# Altium project Controller_Board.PrjPcb
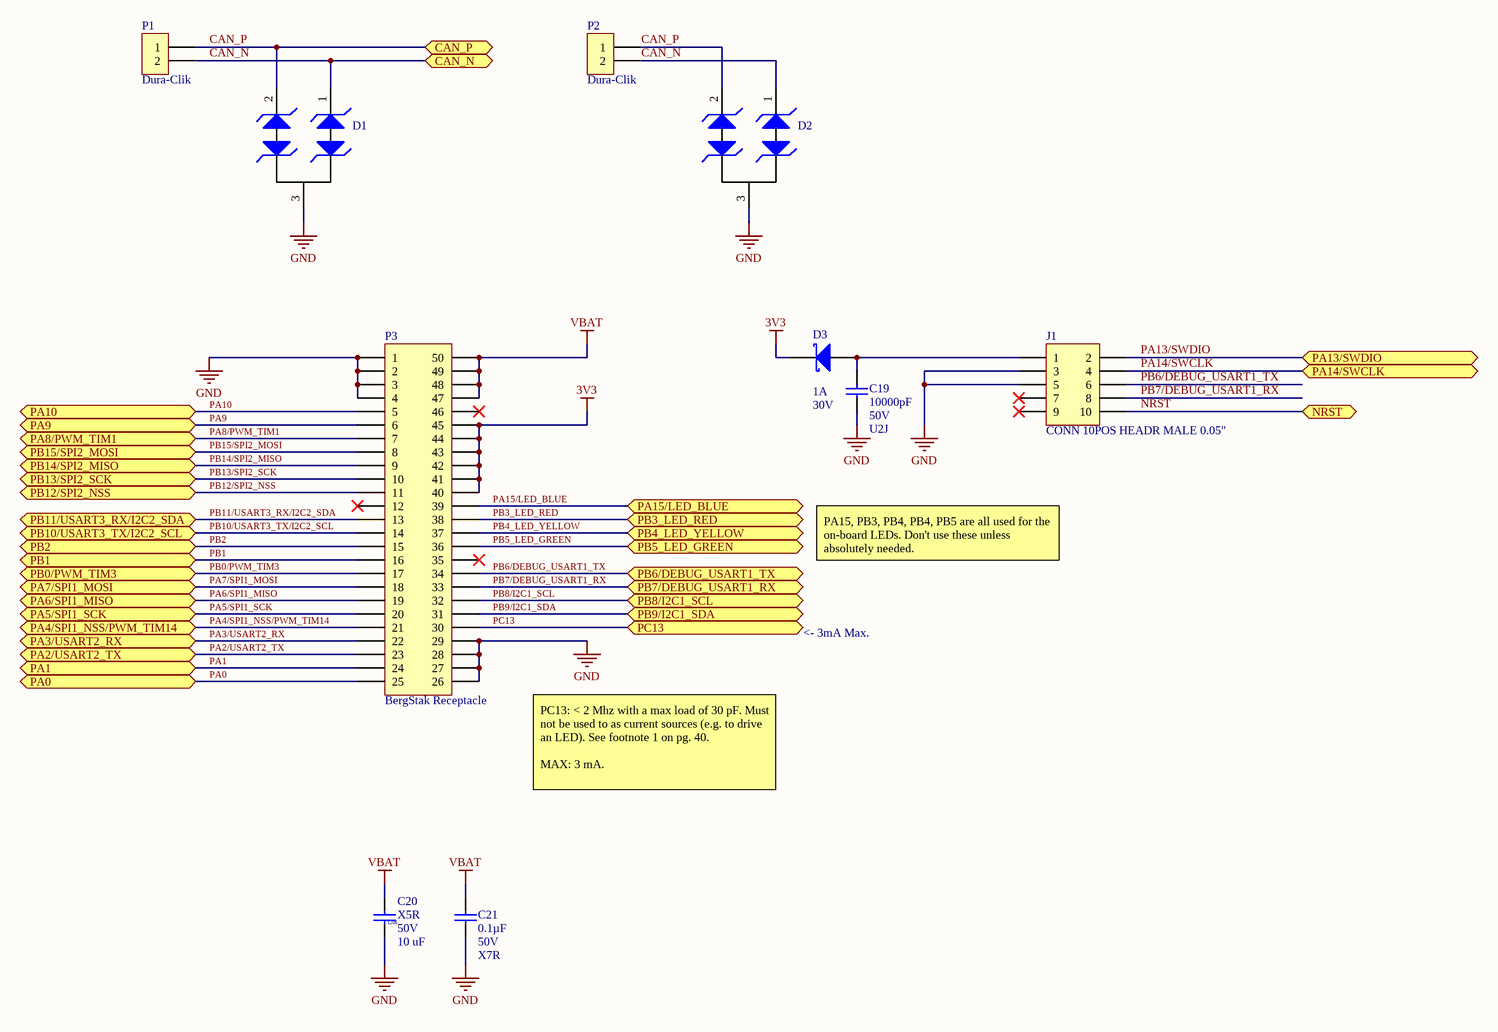
[diagram p0: Controller Board - Connectors.SchDoc]
ProjectRevision: 7.0; ProjectAuthor: Taiping Li; MSPartNumber: MS40001-07; author: Taiping
3 sheets, 48 parts. Net scope: flat (ports and power ports of the same name join across sheets).
Board file: Controller_Board.PcbDoc
Sheets:
  Controller Board - Connectors.SchDoc
  Controller Board - Microcontroller.SchDoc
  Controller_Board.SchDoc

## Sheet Controller Board - Connectors.SchDoc: Controller Board - Connectors
size B; Organization: Midnight Sun Solar Rayce Car Team; Address1: University of Waterloo; Address2: 200 University Ave W; Address3: Waterloo, ON, Canada; Address4: N2L 3E9; DocumentNumber: 1; SheetNumber: 1; SheetTotal: 3; Website: www.uwmidsun.com; ProjectName: ProjectName

### Parts
C19  Capacitance: 10000pF  Voltage: 50V  Temperature Coefficient: U2J  [CAP, 0603]  (hidden comment: CAP CER 10nF 50V 5% X7R 0603)
C20  Rating: X5R  Voltage Rating: 50V  Capacitance: 10 uF  [CAP, 1206]  (hidden comment: CAP CER 10uF 50V 20% X5R 1206)
C21  Capacitance: 0.1µF  Voltage: 50V  Temperature Coefficient: X7R  [CAP, 0603]  (hidden comment: CAP CER 0.1UF 50V 10% X7R 0603)
D1  DIODE TVS 24VWM 70VC SOT23  [MOSFET P-CH 30V 3.8A SOT-23]  (value not drawn)
D2  DIODE TVS 24VWM 70VC SOT23  [MOSFET P-CH 30V 3.8A SOT-23]  (value not drawn)
D3  Current - Average Rectified (Io): 1A  Voltage - DC Reverse (Vr) (Max): 30V  [DIODE SCHOTTKY 30V 1A POWERDI123]  (hidden comment: DIODE SCHOTTKY 30V 1A POWERDI123)
J1  CONN 10POS HEADR MALE 0.05"  [CONN, 10POS 0.05" Debug Header]
P1  Dura-Clik  [CONN, 2POS Dura-Click Vertical]
P2  Dura-Clik  [CONN, 2POS Dura-Click Vertical]
P3  Series: BergStak Receptacle  [CONN, Bergstak 50 Pos Receptacle]  (hidden comment: CONN 50POS Bergstak Receptacle 0.02")

### Ports
CAN_N (bidir), CAN_P (bidir), NRST (bidir), PA0 (bidir), PA1 (bidir), PA2/USART2_TX (bidir), PA3/USART2_RX (bidir), PA4/SPI1_NSS/PWM_TIM14 (bidir), PA5/SPI1_SCK (bidir), PA6/SPI1_MISO (bidir), PA7/SPI1_MOSI (bidir), PA8/PWM_TIM1 (bidir), PA9 (bidir), PA10 (bidir), PA13/SWDIO (bidir), PA14/SWCLK (bidir), PA15/LED_BLUE (bidir), PB0/PWM_TIM3 (bidir), PB1 (bidir), PB2 (bidir), PB3_LED_RED (bidir), PB4_LED_YELLOW (bidir), PB5_LED_GREEN (bidir), PB6/DEBUG_USART1_TX (bidir), PB7/DEBUG_USART1_RX (bidir), PB8/I2C1_SCL (bidir), PB9/I2C1_SDA (bidir), PB10/USART3_TX/I2C2_SCL (bidir), PB11/USART3_RX/I2C2_SDA (bidir), PB12/SPI2_NSS (bidir), PB13/SPI2_SCK (bidir), PB14/SPI2_MISO (bidir), PB15/SPI2_MOSI (bidir), PC13 (bidir)

### Nets
3V3: D3.2(K) P3.40 P3.41 P3.42 P3.43 P3.44 P3.45
GND: C19.2 C20.2 C21.2 D1.3(Common_Cathode) D2.3(Common_Cathode) J1.3 J1.5 P3.1 P3.2 P3.3 P3.4 P3.26 P3.27 P3.28 P3.29
VBAT: C20.1 C21.1 P3.47 P3.48 P3.49 P3.50
CAN_N: D1.1(Cathode1) D2.1(Cathode1) P1.2 P2.2 ; port CAN_N
CAN_P: D1.2(Cathode2) D2.2(Cathode2) P1.1 P2.1 ; port CAN_P
NRST: J1.10 ; port NRST
PA0: P3.25 ; port PA0
PA1: P3.24 ; port PA1
PA2/USART2_TX: P3.23 ; port PA2/USART2_TX
PA3/USART2_RX: P3.22 ; port PA3/USART2_RX
PA4/SPI1_NSS/PWM_TIM14: P3.21 ; port PA4/SPI1_NSS/PWM_TIM14
PA5/SPI1_SCK: P3.20 ; port PA5/SPI1_SCK
PA6/SPI1_MISO: P3.19 ; port PA6/SPI1_MISO
PA7/SPI1_MOSI: P3.18 ; port PA7/SPI1_MOSI
PA8/PWM_TIM1: P3.7 ; port PA8/PWM_TIM1
PA9: P3.6 ; port PA9
PA10: P3.5 ; port PA10
PA13/SWDIO: J1.2 ; port PA13/SWDIO
PA14/SWCLK: J1.4 ; port PA14/SWCLK
PA15/LED_BLUE: P3.39 ; port PA15/LED_BLUE
PB0/PWM_TIM3: P3.17 ; port PB0/PWM_TIM3
PB1: P3.16 ; port PB1
PB2: P3.15 ; port PB2
PB3_LED_RED: P3.38 ; port PB3_LED_RED
PB4_LED_YELLOW: P3.37 ; port PB4_LED_YELLOW
PB5_LED_GREEN: P3.36 ; port PB5_LED_GREEN
PB6/DEBUG_USART1_TX: J1.6 P3.34 ; port PB6/DEBUG_USART1_TX
PB7/DEBUG_USART1_RX: J1.8 P3.33 ; port PB7/DEBUG_USART1_RX
PB8/I2C1_SCL: P3.32 ; port PB8/I2C1_SCL
PB9/I2C1_SDA: P3.31 ; port PB9/I2C1_SDA
PB10/USART3_TX/I2C2_SCL: P3.14 ; port PB10/USART3_TX/I2C2_SCL
PB11/USART3_RX/I2C2_SDA: P3.13 ; port PB11/USART3_RX/I2C2_SDA
PB12/SPI2_NSS: P3.11 ; port PB12/SPI2_NSS
PB13/SPI2_SCK: P3.10 ; port PB13/SPI2_SCK
PB14/SPI2_MISO: P3.9 ; port PB14/SPI2_MISO
PB15/SPI2_MOSI: P3.8 ; port PB15/SPI2_MOSI
PC13: P3.30 ; port PC13
NetC19_1: C19.1 D3.1(A) J1.1

Not connected (* = marked no-connect by the designer): J1 7* 9*; P3 12* 35* 46*

### Notes on the sheet
- PA15, PB3, PB4, PB4, PB5 are all used for the on-board LEDs. Don't use these unless absolutely needed.
- <- 3mA Max.
- PC13: < 2 Mhz with a max load of 30 pF. Must not be used to as current sources (e.g. to drive an LED). See footnote 1 on pg. 40.
  MAX: 3 mA.
- PROJECT
- DOCUMENT
- DRAWN BY
- LAST MODIFIED
- PART NUMBER
- REVISION
- SHEET
- VARIANT
- OF
- Engineering 5 - 1002
  University of Waterloo
  (519) 888-4567 x32978
  hardware@uwmidsun.com

### Library data of the parts
C19 = CAP CER 10nF 50V 5% X7R 0603: 10000pF ±5% 50V Ceramic Capacitor U2J 0603 (1608 Metric); Manufacturer 1: KEMET; Manufacturer Part Number 1: C0603C103J5JAC7867; Supplier 1: Digi-Key; Supplier Part Number 1: 399-13384-1-ND; Packaging: Cut Tape (CT); Part Status: Active; Operating Temperature: -55°C ~ 125°C; Ratings: -; Mounting Type: Surface Mount, MLCC; Package / Case: 0603 (1608 Metric); Size / Dimension: 0.063" L x 0.032" W (1.60mm x 0.80mm); Height - Seated (Max): -; Thickness (Max): 0.034" (0.87mm); Lead Spacing: -; Lead Style: -; ComponentLink1URL: http://www.kemet.com/docfinder?Partnumber=C0603C103J5JAC7867; ComponentLink1Description: http://www.kemet.com/docfinder?Partnumber=C0603C103J5JAC7867; Tolerance: ±5%; Failure Rate: -
C20 = CAP CER 10uF 50V 20% X5R 1206: 10µF ±20% 50V Ceramic Capacitor X5R 1206 (3216 Metric) /; Manufacturer: Murata; Manufacturer Part Number: GRT31CR61H106ME01L; Supplier 1: Digi-Key; Supplier Part Number 1: 490-12457-1-ND; RoHS: Yes; Stock 1: 449467; Pricing 1: 1 = 0.57000, 10 = 0.39800, 100 = 0.23910, 500 = 0.17930, 1000 = 0.15141 (USD); Mount: Surface Mount; Case/Package: 1206; Case Code (Metric): 3216; Case Code (Imperial): 1206; Min Operating Temperature: -55°C; Max Operating Temperature: 85°C; Packaging: Tape and Reel; Tolerance: 20%; Length: 0.126inch; Width: 0.063inch; Thickness: 0.071inch; Ratings: AEC-Q200
C21 = CAP CER 0.1UF 50V 10% X7R 0603: 0.10µF ±10% 50V Ceramic Capacitor X7R 0603 (1608 Metric); Manufacturer 1: AVX Corporation; Manufacturer Part Number 1: 06035C104KAT2A; Supplier 1: Digi-Key; Supplier Part Number 1: 478-5052-1-ND; Packaging: Cut Tape (CT); Part Status: Active; Operating Temperature: -55°C ~ 125°C; Ratings: -; Mounting Type: Surface Mount, MLCC; Package / Case: 0603 (1608 Metric); Size / Dimension: 0.063" L x 0.032" W (1.60mm x 0.81mm); Height - Seated (Max): -; Thickness (Max): 0.035" (0.90mm); Lead Spacing: -; Lead Style: -; ComponentLink1URL: http://datasheets.avx.com/X7RDielectric.pdf; ComponentLink1Description: http://datasheets.avx.com/X7RDielectric.pdf; Tolerance: ±10%
D1 D2 = DIODE TVS 24VWM 70VC SOT23: TVS DIODE 24VWM 70VC SOT23; Manufacturer 1: Nexperia USA Inc.; Manufacturer Part Number 1: PESD1CAN,215; Type: Zener; Voltage - Breakdown (Min): 25.4V; Voltage - Clamping (Max) @ Ipp: 70V; Current - Peak Pulse (10/1000µs): 3A (8/20µs); Power - Peak Pulse: 200W; Power Line Protection: No; Capacitance @ Frequency: 11pF @ 1MHz; Supplier 1: Digi-Key; Supplier Part Number 1: 1727-3817-1-ND; Packaging: Cut Tape (CT); Part Status: Active; Operating Temperature: -65°C ~ 150°C (TA); Mounting Type: Surface Mount; Package / Case: TO-236-3, SC-59, SOT-23-3; Supplier Device Package: SOT-23 (TO-236AB); ComponentLink1URL: http://assets.nexperia.com/documents/data-sheet/PESD1CAN.pdf; ComponentLink1Description: http://assets.nexperia.com/documents/data-sheet/PESD1CAN.pdf
D3 = DIODE SCHOTTKY 30V 1A POWERDI123: Diode Schottky 30V 1A Surface Mount PowerDI™ 123; Manufacturer: Diodes Incorporated; Manufacturer Part Number: DFLS130L-7; Speed: Fast Recovery =< 500ns, > 200mA (Io); Current - Reverse Leakage @ Vr: 1mA @ 30V; Capacitance @ Vr, F: 76pF @ 10V, 1MHz; Voltage - Forward (Vf) (Max) @ If: 310mV @ 1A; Supplier 1: Digi-Key; RoHS: RoHS Compliant; Category: Discrete Semiconductor Products; Stock 1: 68200; Packaging: Cut Tape (CT); Part Status: Active; Diode Type: Schottky; Mounting Type: Surface Mount; Package / Case: POWERDI®123; Supplier Device Package: PowerDI™ 123; Operating Temperature - Junction: -40°C ~ 125°C; ComponentLink1URL: https://www.diodes.com/assets/Datasheets/ds30492.pdf; ComponentLink1Description: https://www.diodes.com/assets/Datasheets/ds30492.pdf; Supplier Part Number 1: DFLS130LDICT-ND; Pricing 1: 1=0.7, 10=0.599, 100=0.447, 500=0.35126, 1000=0.27142 (CAD)
J1 = CONN 10POS HEADR MALE 0.05": 10 Positions Header Connector 0.050" (1.27mm) Surface Mount Gold; Manufacturer 1: Amphenol FCI; Manufacturer Part Number 1: 20021121-00010C4LF; Style: Board to Board; Shrouding: Unshrouded; Number of Positions: 10; Number of Positions Loaded: All; Contact Length - Mating: 0.120" (3.05mm); Material Flammability Rating: UL94 V-0; Supplier 1: Digi-Key; Supplier Part Number 1: 609-3695-1-ND; Packaging: Cut Tape (CT); Part Status: Active; Connector Type: Header; Contact Type: Male Pin; Number of Rows: 2; Row Spacing - Mating: 0.050" (1.27mm); Mounting Type: Surface Mount; Termination: Solder; Fastening Type: -; Contact Length - Post: -; Overall Contact Length: -; Insulation Height: -; Contact Shape: Square; Contact Finish - Mating: Gold; Contact Finish Thickness - Mating: 10µin (0.25µm); Contact Finish - Post: Tin; Contact Material: Copper Alloy; Insulation Material: Thermoplastic; Operating Temperature: -; Ingress Protection: -; Insulation Color: Black; Current Rating: -; Mated Stacking Heights: -; Contact Finish Thickness - Post: 50µin (1.27µm); ComponentLink1URL: http://portal.fciconnect.com/Comergent//fci/drawing/20021121.pdf; ComponentLink1Description: http://portal.fciconnect.com/Comergent//fci/drawing/20021121.pdf; Voltage: -; Pitch - Mating: 0.050" (1.27mm)
P1 P2 = CONN 2POS DURA-CLIK 0.079" VERT: 2 Positions Header, Shrouded Connector 0.079" (2.00mm) Surface Mount, Vertical Tin; Manufacturer: Molex, LLC; Manufacturer Part Number: 5600200220; Style: Board to Cable/Wire; Shrouding: Shrouded - 4 Wall; Number of Positions: 2; Number of Positions Loaded: All; Mated Stacking Heights: 9.3mm; Supplier 1: Digi-Key; RoHS: RoHS Compliant; Category: Connectors, Interconnects; Stock 1: 11912; Pricing 1: 1=1.16, 10=1.012, 25=0.952, 50=0.9122, 100=0.8727, 250=0.79336 (CAD); Packaging: Cut Tape (CT); Part Status: Active; Connector Type: Header; Contact Type: Male Pin; Pitch - Mating: 0.079" (2.00mm); Number of Rows: 1; Row Spacing - Mating: -; Mounting Type: Surface Mount; Termination: Solder; Fastening Type: Latch Lock; Contact Length - Mating: -; Contact Length - Post: -; Overall Contact Length: -; Insulation Height: 0.315" (8.00mm); Contact Shape: Square; Contact Finish - Mating: Tin; Contact Finish Thickness - Mating: -; Contact Finish - Post: Tin; Contact Material: Copper Alloy; Insulation Material: Polyamide (PA), Nylon; Features: Solder Retention; Operating Temperature: -; Ingress Protection: -; Material Flammability Rating: -; Insulation Color: Natural; Current Rating: -; Voltage Rating: -; Contact Finish Thickness - Post: -; Applications: Automotive, Industrial; ComponentLink1URL: http://www.molex.com/pdm_docs/sd/5600200220_sd.pdf; ComponentLink1Description: http://www.molex.com/pdm_docs/sd/5600200220_sd.pdf; Supplier Part Number 1: WM10862CT-ND
P3 = CONN 50POS Bergstak Receptacle 0.02": 50 Position Connector Receptacle, Center Strip Contacts Surface Mount Gold; Manufacturer 1: Amphenol FCI; Manufacturer Part Number 1: 10132798-052100LF; Number of Positions: 50; Mated Stacking Heights: 5mm, 5.5mm, 6mm; Pitch: 0.020" (0.50mm); Supplier 1: Digi-Key; Supplier Part Number 1: 609-5227-1-ND; Packaging: Cut Tape (CT); Part Status: Active; Connector Type: Receptacle, Center Strip Contacts; Number of Rows: 2; Mounting Type: Surface Mount; Contact Finish: Gold; Contact Finish Thickness: 1µin (0.025µm); Height Above Board: 0.106" (2.70mm); ComponentLink1URL: http://portal.fciconnect.com/Comergent//fci/drawing/10132798.pdf; ComponentLink1Description: http://portal.fciconnect.com/Comergent//fci/drawing/10132798.pdf

## Sheet Controller Board - Microcontroller.SchDoc: Controller Board - Microcontroller
size B; Organization: Midnight Sun Solar Rayce Car Team; Address1: University of Waterloo; Address2: 200 University Ave W; Address3: Waterloo, ON, Canada; Address4: N2L 3E9; DocumentNumber: 2; SheetNumber: 2; SheetTotal: 3; Website: www.uwmidsun.com; ProjectName: ProjectName
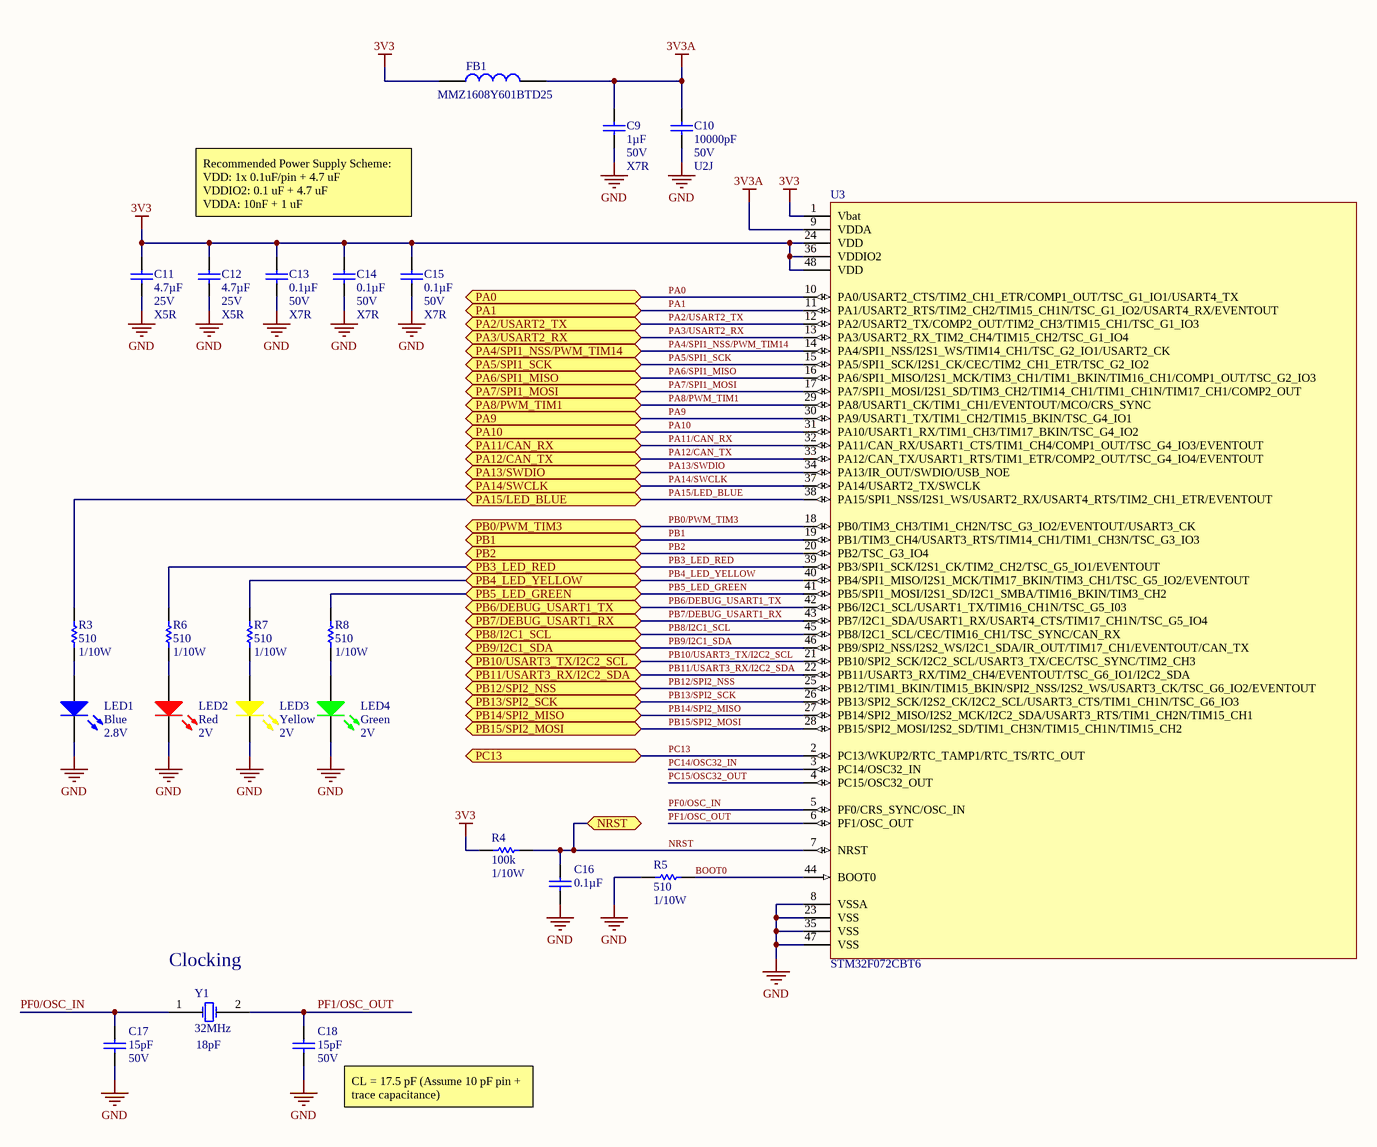
[diagram p1: Controller Board - Microcontroller.SchDoc]

### Parts
C9  Capacitance: 1µF  Voltage: 50V  Temperature Coefficient: X7R  [CAP, 0603]  (hidden comment: CAP CER 1UF 50V 10% X7R 0603)
C10  Capacitance: 10000pF  Voltage: 50V  Temperature Coefficient: U2J  [CAP, 0603]  (hidden comment: CAP CER 10nF 50V 5% X7R 0603)
C11  Capacitance: 4.7µF  Voltage: 25V  Temperature Coefficient: X5R  [CAP, 0603]  (hidden comment: CAP CER 4.7UF 25V 10% X5R 0603)
C12  Capacitance: 4.7µF  Voltage: 25V  Temperature Coefficient: X5R  [CAP, 0603]  (hidden comment: CAP CER 4.7UF 25V 10% X5R 0603)
C13  Capacitance: 0.1µF  Voltage: 50V  Temperature Coefficient: X7R  [CAP, 0603]  (hidden comment: CAP CER 0.1UF 50V 10% X7R 0603)
C14  Capacitance: 0.1µF  Voltage: 50V  Temperature Coefficient: X7R  [CAP, 0603]  (hidden comment: CAP CER 0.1UF 50V 10% X7R 0603)
C15  Capacitance: 0.1µF  Voltage: 50V  Temperature Coefficient: X7R  [CAP, 0603]  (hidden comment: CAP CER 0.1UF 50V 10% X7R 0603)
C16  Capacitance: 0.1µF  [CAP, 0603]  (hidden comment: CAP CER 0.1UF 50V 10% X7R 0603)
C17  Voltage: 50V  Capacitance: 15pF  [CAP, 0603]  (hidden comment: CAP CER 15PF 50V ±5% NPO 0603)
C18  Voltage: 50V  Capacitance: 15pF  [CAP, 0603]  (hidden comment: CAP CER 15PF 50V ±5% NPO 0603)
FB1  Manufacturer Part Number: MMZ1608Y601BTD25  [FB 0603]  (hidden comment: FB 600 OHM 1LN 0603)
LED1  Color: Blue  Voltage - Forward (Vf) (Typ): 2.8V  [LED_0603]  (hidden comment: LED BLUE CLEAR 2.8V 0603)
LED2  Color: Red  Voltage - Forward (Vf) (Typ): 2V  [LED_0603]  (hidden comment: LED RED CLEAR 2V 0603)
LED3  Color: Yellow  Voltage - Forward (Vf) (Typ): 2V  [LED_0603]  (hidden comment: LED YELLOW CLEAR 2.1V 0603)
LED4  Color: Green  Voltage - Forward (Vf) (Typ): 2V  [LED_0603]  (hidden comment: LED GREEN CLEAR 2V 0603)
R3  Resistance: 510  Power: 1/10W  [RES, 0603]  (hidden comment: RES 510 OHM 5% 1/10W 0603)
R4  Resistance: 100k  Power: 1/10W  [RES, 0603]  (hidden comment: RES 100K OHM 5% 1/8W 0603)
R5  Resistance: 510  Power: 1/10W  [RES, 0603]  (hidden comment: RES 510 OHM 5% 1/10W 0603)
R6  Resistance: 510  Power: 1/10W  [RES, 0603]  (hidden comment: RES 510 OHM 5% 1/10W 0603)
R7  Resistance: 510  Power: 1/10W  [RES, 0603]  (hidden comment: RES 510 OHM 5% 1/10W 0603)
R8  Resistance: 510  Power: 1/10W  [RES, 0603]  (hidden comment: RES 510 OHM 5% 1/10W 0603)
U3  Manufacturer Part Number 1: STM32F072CBT6  [TSQFP50P890X890X160-48M]  (hidden comment: IC MCU 32BIT 128KB FLASH 48LQFP)
Y1  Load Capacitance: 18pF  Frequency: 32MHz  [CRYSTAL ABM7]  (hidden comment: CRYSTAL 32 MHz 18PF 2-SMD)

### Ports
NRST (bidir), PA0 (bidir), PA1 (bidir), PA2/USART2_TX (bidir), PA3/USART2_RX (bidir), PA4/SPI1_NSS/PWM_TIM14 (bidir), PA5/SPI1_SCK (bidir), PA6/SPI1_MISO (bidir), PA7/SPI1_MOSI (bidir), PA8/PWM_TIM1 (bidir), PA9 (bidir), PA10 (bidir), PA11/CAN_RX (bidir), PA12/CAN_TX (bidir), PA13/SWDIO (bidir), PA14/SWCLK (bidir), PA15/LED_BLUE (bidir), PB0/PWM_TIM3 (bidir), PB1 (bidir), PB2 (bidir), PB3_LED_RED (bidir), PB4_LED_YELLOW (bidir), PB5_LED_GREEN (bidir), PB6/DEBUG_USART1_TX (bidir), PB7/DEBUG_USART1_RX (bidir), PB8/I2C1_SCL (bidir), PB9/I2C1_SDA (bidir), PB10/USART3_TX/I2C2_SCL (bidir), PB11/USART3_RX/I2C2_SDA (bidir), PB12/SPI2_NSS (bidir), PB13/SPI2_SCK (bidir), PB14/SPI2_MISO (bidir), PB15/SPI2_MOSI (bidir), PC13 (bidir)

### Nets
3V3: C11.1 C12.1 C13.1 C14.1 C15.1 FB1.1 R4.2 U3.1(Vbat) U3.24(VDD) U3.36(VDDIO2) U3.48(VDD)
3V3A: C9.1 C10.1 FB1.2 U3.9(VDDA)
GND: C9.2 C10.2 C11.2 C12.2 C13.2 C14.2 C15.2 C16.1 C17.1 C18.1 LED1.2(K) LED2.2(K) LED3.2(K) LED4.2(K) R5.1 U3.8(VSSA) U3.23(VSS) U3.35(VSS) U3.47(VSS)
BOOT0: R5.2 U3.44(BOOT0)
NRST: C16.2 R4.1 U3.7(NRST) ; port NRST
PA0: U3.10(PA0/USART2_CTS/TIM2_CH1_ETR/COMP1_OUT/TSC_G1_IO1/USART4_TX) ; port PA0
PA1: U3.11(PA1/USART2_RTS/TIM2_CH2/TIM15_CH1N/TSC_G1_IO2/USART4_RX/EVENTOUT) ; port PA1
PA2/USART2_TX: U3.12(PA2/USART2_TX/COMP2_OUT/TIM2_CH3/TIM15_CH1/TSC_G1_IO3) ; port PA2/USART2_TX
PA3/USART2_RX: U3.13(PA3/USART2_RX_TIM2_CH4/TIM15_CH2/TSC_G1_IO4) ; port PA3/USART2_RX
PA4/SPI1_NSS/PWM_TIM14: U3.14(PA4/SPI1_NSS/I2S1_WS/TIM14_CH1/TSC_G2_IO1/USART2_CK) ; port PA4/SPI1_NSS/PWM_TIM14
PA5/SPI1_SCK: U3.15(PA5/SPI1_SCK/I2S1_CK/CEC/TIM2_CH1_ETR/TSC_G2_IO2) ; port PA5/SPI1_SCK
PA6/SPI1_MISO: U3.16(PA6/SPI1_MISO/I2S1_MCK/TIM3_CH1/TIM1_BKIN/TIM16_CH1/COMP1_OUT/TSC_G2_IO3) ; port PA6/SPI1_MISO
PA7/SPI1_MOSI: U3.17(PA7/SPI1_MOSI/I2S1_SD/TIM3_CH2/TIM14_CH1/TIM1_CH1N/TIM17_CH1/COMP2_OUT) ; port PA7/SPI1_MOSI
PA8/PWM_TIM1: U3.29(PA8/USART1_CK/TIM1_CH1/EVENTOUT/MCO/CRS_SYNC) ; port PA8/PWM_TIM1
PA9: U3.30(PA9/USART1_TX/TIM1_CH2/TIM15_BKIN/TSC_G4_IO1) ; port PA9
PA10: U3.31(PA10/USART1_RX/TIM1_CH3/TIM17_BKIN/TSC_G4_IO2) ; port PA10
PA11/CAN_RX: U3.32(PA11/CAN_RX/USART1_CTS/TIM1_CH4/COMP1_OUT/TSC_G4_IO3/EVENTOUT) ; port PA11/CAN_RX
PA12/CAN_TX: U3.33(PA12/CAN_TX/USART1_RTS/TIM1_ETR/COMP2_OUT/TSC_G4_IO4/EVENTOUT) ; port PA12/CAN_TX
PA13/SWDIO: U3.34(PA13/IR_OUT/SWDIO/USB_NOE) ; port PA13/SWDIO
PA14/SWCLK: U3.37(PA14/USART2_TX/SWCLK) ; port PA14/SWCLK
PA15/LED_BLUE: R3.1 U3.38(PA15/SPI1_NSS/I2S1_WS/USART2_RX/USART4_RTS/TIM2_CH1_ETR/EVENTOUT) ; port PA15/LED_BLUE
PB0/PWM_TIM3: U3.18(PB0/TIM3_CH3/TIM1_CH2N/TSC_G3_IO2/EVENTOUT/USART3_CK) ; port PB0/PWM_TIM3
PB1: U3.19(PB1/TIM3_CH4/USART3_RTS/TIM14_CH1/TIM1_CH3N/TSC_G3_IO3) ; port PB1
PB2: U3.20(PB2/TSC_G3_IO4) ; port PB2
PB3_LED_RED: R6.1 U3.39(PB3/SPI1_SCK/I2S1_CK/TIM2_CH2/TSC_G5_IO1/EVENTOUT) ; port PB3_LED_RED
PB4_LED_YELLOW: R7.1 U3.40(PB4/SPI1_MISO/I2S1_MCK/TIM17_BKIN/TIM3_CH1/TSC_G5_IO2/EVENTOUT) ; port PB4_LED_YELLOW
PB5_LED_GREEN: R8.1 U3.41(PB5/SPI1_MOSI/I2S1_SD/I2C1_SMBA/TIM16_BKIN/TIM3_CH2) ; port PB5_LED_GREEN
PB6/DEBUG_USART1_TX: U3.42(PB6/I2C1_SCL/USART1_TX/TIM16_CH1N/TSC_G5_I03) ; port PB6/DEBUG_USART1_TX
PB7/DEBUG_USART1_RX: U3.43(PB7/I2C1_SDA/USART1_RX/USART4_CTS/TIM17_CH1N/TSC_G5_IO4) ; port PB7/DEBUG_USART1_RX
PB8/I2C1_SCL: U3.45(PB8/I2C1_SCL/CEC/TIM16_CH1/TSC_SYNC/CAN_RX) ; port PB8/I2C1_SCL
PB9/I2C1_SDA: U3.46(PB9/SPI2_NSS/I2S2_WS/I2C1_SDA/IR_OUT/TIM17_CH1/EVENTOUT/CAN_TX) ; port PB9/I2C1_SDA
PB10/USART3_TX/I2C2_SCL: U3.21(PB10/SPI2_SCK/I2C2_SCL/USART3_TX/CEC/TSC_SYNC/TIM2_CH3) ; port PB10/USART3_TX/I2C2_SCL
PB11/USART3_RX/I2C2_SDA: U3.22(PB11/USART3_RX/TIM2_CH4/EVENTOUT/TSC_G6_IO1/I2C2_SDA) ; port PB11/USART3_RX/I2C2_SDA
PB12/SPI2_NSS: U3.25(PB12/TIM1_BKIN/TIM15_BKIN/SPI2_NSS/I2S2_WS/USART3_CK/TSC_G6_IO2/EVENTOUT) ; port PB12/SPI2_NSS
PB13/SPI2_SCK: U3.26(PB13/SPI2_SCK/I2S2_CK/I2C2_SCL/USART3_CTS/TIM1_CH1N/TSC_G6_IO3) ; port PB13/SPI2_SCK
PB14/SPI2_MISO: U3.27(PB14/SPI2_MISO/I2S2_MCK/I2C2_SDA/USART3_RTS/TIM1_CH2N/TIM15_CH1) ; port PB14/SPI2_MISO
PB15/SPI2_MOSI: U3.28(PB15/SPI2_MOSI/I2S2_SD/TIM1_CH3N/TIM15_CH1N/TIM15_CH2) ; port PB15/SPI2_MOSI
PC13: U3.2(PC13/WKUP2/RTC_TAMP1/RTC_TS/RTC_OUT) ; port PC13
PC14/OSC32_IN: U3.3(PC14/OSC32_IN)
PC15/OSC32_OUT: U3.4(PC15/OSC32_OUT)
PF0/OSC_IN: C17.2 U3.5(PF0/CRS_SYNC/OSC_IN) Y1.1
PF1/OSC_OUT: C18.2 U3.6(PF1/OSC_OUT) Y1.2
NetLED1_1: LED1.1(A) R3.2
NetLED2_1: LED2.1(A) R6.2
NetLED3_1: LED3.1(A) R7.2
NetLED4_1: LED4.1(A) R8.2

### Notes on the sheet
- Recommended Power Supply Scheme:
  VDD: 1x 0.1uF/pin + 4.7 uF
  VDDIO2: 0.1 uF + 4.7 uF
  VDDA: 10nF + 1 uF
- (near Y1) Clocking
- (near C18) CL = 17.5 pF (Assume 10 pF pin + trace capacitance)
- PROJECT
- DOCUMENT
- DRAWN BY
- LAST MODIFIED
- PART NUMBER
- REVISION
- SHEET
- VARIANT
- OF
- Engineering 5 - 1002
  University of Waterloo
  (519) 888-4567 x32978
  hardware@uwmidsun.com

### Library data of the parts
C9 = CAP CER 1UF 50V 10% X7R 0603: 1µF ±10% 50V Ceramic Capacitor X7R 0603 (1608 Metric); Manufacturer 1: Taiyo Yuden; Manufacturer Part Number 1: UMK107AB7105KA-T; Supplier 1: Digi-Key; Supplier Part Number 1: 587-3247-1-ND; Packaging: Cut Tape (CT); Part Status: Active; Operating Temperature: -55°C ~ 125°C; Ratings: -; Mounting Type: Surface Mount, MLCC; Package / Case: 0603 (1608 Metric); Size / Dimension: 0.063" L x 0.031" W (1.60mm x 0.80mm); Height - Seated (Max): -; Thickness (Max): 0.037" (0.95mm); Lead Spacing: -; Lead Style: -; ComponentLink1URL: http://www.yuden.co.jp/productdata/catalog/en/mlcc_all_e.pdf; ComponentLink1Description: http://www.yuden.co.jp/productdata/catalog/en/mlcc_all_e.pdf; Tolerance: ±10%
C10 = CAP CER 10nF 50V 5% X7R 0603: as C19 on sheet Controller Board - Connectors; Supplier 1: Digi-Key; Supplier Part Number 1: 399-13384-1-ND; Packaging: Cut Tape (CT); Part Status: Active; Operating Temperature: -55°C ~ 125°C; Ratings: -; Failure Rate: -; Mounting Type: Surface Mount, MLCC; Package / Case: 0603 (1608 Metric); Size / Dimension: 0.063" L x 0.032" W (1.60mm x 0.80mm); Height - Seated (Max): -; Thickness (Max): 0.034" (0.87mm); Lead Spacing: -; Lead Style: -; ComponentLink1URL: http://www.kemet.com/docfinder?Partnumber=C0603C103J5JAC7867; ComponentLink1Description: http://www.kemet.com/docfinder?Partnumber=C0603C103J5JAC7867; Tolerance: ±5%
C11 C12 = CAP CER 4.7UF 25V 10% X5R 0603: 4.7µF ±10% 25V Ceramic Capacitor X5R 0603 (1608 Metric); Manufacturer 1: Murata Electronics North America; Manufacturer Part Number 1: GRM188R61E475KE11D; Supplier 1: Digi-Key; Supplier Part Number 1: 490-7203-1-ND; Packaging: Cut Tape (CT); Part Status: Active; Operating Temperature: -55°C ~ 85°C; Ratings: -; Mounting Type: Surface Mount, MLCC; Package / Case: 0603 (1608 Metric); Size / Dimension: 0.063" L x 0.031" W (1.60mm x 0.80mm); Height - Seated (Max): -; Thickness (Max): 0.031" (0.80mm); Lead Spacing: -; Lead Style: -; ComponentLink1URL: http://www.murata.com/~/media/webrenewal/support/library/catalog/products/capacitor/mlcc/c02e.ashx; ComponentLink1Description: http://www.murata.com/~/media/webrenewal/support/library/catalog/products/capacitor/mlcc/c02e.ashx; Tolerance: ±10%
C13-C16 = CAP CER 0.1UF 50V 10% X7R 0603: as C21 on sheet Controller Board - Connectors; Supplier 1: Digi-Key; Supplier Part Number 1: 478-5052-1-ND; Packaging: Cut Tape (CT); Part Status: Active; Operating Temperature: -55°C ~ 125°C; Ratings: -; Mounting Type: Surface Mount, MLCC; Package / Case: 0603 (1608 Metric); Size / Dimension: 0.063" L x 0.032" W (1.60mm x 0.81mm); Height - Seated (Max): -; Thickness (Max): 0.035" (0.90mm); Lead Spacing: -; Lead Style: -; ComponentLink1URL: http://datasheets.avx.com/X7RDielectric.pdf; ComponentLink1Description: http://datasheets.avx.com/X7RDielectric.pdf; Tolerance: ±10%
  C16: Voltage: 50V; Temperature Coefficient: X7R
C17 C18 = CAP CER 15PF 50V ±5% NPO 0603: 15pF ±5% 50V Ceramic Capacitor C0G, NP0 0603 (1608 Metric); Manufacturer 1: Yageo; Manufacturer Part Number 1: CC0603JRNPO9BN150; Supplier 1: Digi-Key; Supplier Part Number 1: 311-1060-1-ND; Packaging: Cut Tape (CT); Part Status: Active; Operating Temperature: -55°C ~ 125°C; Ratings: -; Failure Rate: -; Mounting Type: Surface Mount, MLCC; Package / Case: 0603 (1608 Metric); Size / Dimension: 0.063" L x 0.031" W (1.60mm x 0.80mm); Height - Seated (Max): -; Thickness (Max): 0.035" (0.90mm); Lead Spacing: -; Lead Style: -; ComponentLink1URL: http://www.yageo.com/documents/recent/UPY-GP_NP0_16V-to-50V_16.pdf; ComponentLink1Description: http://www.yageo.com/documents/recent/UPY-GP_NP0_16V-to-50V_16.pdf; Tolerance: ±5%; Temperature Coefficient: C0G, NP0
FB1 = FB 600 OHM 1LN 0603: FERRITE BEAD 600 OHM 0603 1LN; Manufacturer: TDK; Number of Lines: 1; Max Current Rating: 500mA; DC Resistance (DCR): 400mR; Impedance: 600R; Tolerance: 25%; Test Frequency: 100MHz; Supplier 1: Digi-Key; Supplier Part Number 1: 445-172850-1-ND; RoHS: Yes; Stock 1: 19540; Pricing 1: 1 = 0.10000, 10 = 0.07600, 25 = 0.06840, 50 = 0.05000, 100 = 0.04330, 250 = 0.03416, 500 = 0.02884, 1000 = 0.02429 (USD); Mount: Surface Mount; Case/Package: 0603; Weight: 7.1E-05oz; Case Code (Metric): 1608; Case Code (Imperial): 0603; Min Operating Temperature: -55°C; Max Operating Temperature: 125°C; Package Quantity: 4000; Packaging: Tape and Reel; Termination: SMD/SMT; Max DC Current: 500mA; Length: 0.063inch; Height: 0.037inch; Width: 0.031inch; Ratings: AEC-Q200
LED1 = LED BLUE CLEAR 2.8V 0603: Blue 470nm LED Indication - Discrete 2.8V 0603 (1608 Metric); Manufacturer 1: Lite-On Inc.; Manufacturer Part Number 1: LTST-C193TBKT-5A; Lens Color: Colorless; Millicandela Rating: 15mcd; Lens Style/Size: Rectangle with Flat Top, 1.15mm x 0.80mm; Current - Test: 5mA; Viewing Angle: 130°; Wavelength - Peak: 468nm; Supplier 1: Digi-Key; Supplier Part Number 1: 160-1827-1-ND; Packaging: Cut Tape (CT); Part Status: Active; Lens Transparency: Clear; Mounting Type: Surface Mount; Wavelength - Dominant: 470nm; Package / Case: 0603 (1608 Metric); Supplier Device Package: Chip LED; Size / Dimension: 1.60mm L x 0.80mm W; Height (Max): 0.45mm; ComponentLink1URL: http://optoelectronics.liteon.com/upload/download/DS22-2004-060/P_100_LTST-C193TBKT-5A.pdf; ComponentLink1Description: http://optoelectronics.liteon.com/upload/download/DS22-2004-060/P_100_LTST-C193TBKT-5A.pdf
LED2 = LED RED CLEAR 2V 0603: Red 631nm LED Indication - Discrete 2V 0603 (1608 Metric); Manufacturer: Wurth Electronics Inc.; Manufacturer Part Number: 150060RS75000; Lens Color: Colorless; Millicandela Rating: 250mcd; Lens Style/Size: Rectangle with Flat Top, 1.10mm x 0.70mm; Current - Test: 20mA; Viewing Angle: 140°; Wavelength - Dominant: 625nm; Wavelength - Peak: 630nm; Supplier 1: Digi-Key; RoHS: RoHS Compliant; Category: Optoelectronics; Stock 1: 35521; Pricing 1: 1=0.21, 100=0.1617, 500=0.13964 (CAD); Packaging: Cut Tape (CT); Part Status: Active; Lens Transparency: Clear; Mounting Type: Surface Mount; Features: -; Package / Case: 0603 (1608 Metric); Supplier Device Package: 0603; Size / Dimension: 1.60mm L x 0.80mm W; Height (Max): 0.80mm; ComponentLink1URL: http://katalog.we-online.de/led/datasheet/150060RS75000.pdf; ComponentLink1Description: http://katalog.we-online.de/led/datasheet/150060RS75000.pdf; Supplier Part Number 1: 732-4978-1-ND
LED3 = LED YELLOW CLEAR 2.1V 0603: Yellow 590nm LED Indication - Discrete 2V 0603 (1608 Metric); Manufacturer: Wurth Electronics Inc.; Manufacturer Part Number: 150060YS75000; Lens Color: Colorless; Millicandela Rating: 120mcd; Lens Style/Size: Rectangle with Flat Top, 1.10mm x 0.70mm; Current - Test: 20mA; Viewing Angle: 140°; Wavelength - Peak: 595nm; Supplier 1: Digi-Key; RoHS: RoHS Compliant; Category: Optoelectronics; Stock 1: 10523; Pricing 1: 1=0.21, 100=0.1617, 500=0.13964 (CAD); Packaging: Cut Tape (CT); Part Status: Active; Lens Transparency: Clear; Mounting Type: Surface Mount; Wavelength - Dominant: 590nm; Features: -; Package / Case: 0603 (1608 Metric); Supplier Device Package: 0603; Size / Dimension: 1.60mm L x 0.80mm W; Height (Max): 0.80mm; ComponentLink1URL: http://katalog.we-online.de/led/datasheet/150060YS75000.pdf; ComponentLink1Description: http://katalog.we-online.de/led/datasheet/150060YS75000.pdf; Supplier Part Number 1: 732-4981-1-ND
LED4 = LED GREEN CLEAR 2V 0603: Green 572nm LED Indication - Discrete 2V 0603 (1608 Metric); Manufacturer: Wurth Electronics Inc.; Manufacturer Part Number: 150060VS75000; Lens Color: Colorless; Millicandela Rating: 40mcd; Lens Style/Size: Rectangle with Flat Top, 1.10mm x 0.70mm; Current - Test: 20mA; Viewing Angle: 140°; Wavelength - Dominant: 570nm; Supplier 1: Digi-Key; RoHS: RoHS Compliant; Category: Optoelectronics; Stock 1: 9408; Pricing 1: 1=0.21, 100=0.1617, 500=0.13964 (CAD); Packaging: Cut Tape (CT); Part Status: Active; Lens Transparency: Clear; Mounting Type: Surface Mount; Wavelength - Peak: 572nm; Features: -; Package / Case: 0603 (1608 Metric); Supplier Device Package: 0603; Size / Dimension: 1.60mm L x 0.80mm W; Height (Max): 0.80mm; ComponentLink1URL: http://katalog.we-online.de/led/datasheet/150060VS75000.pdf; ComponentLink1Description: http://katalog.we-online.de/led/datasheet/150060VS75000.pdf; Supplier Part Number 1: 732-4980-1-ND
R3 R5-R8 = RES 510 OHM 5% 1/10W 0603: RES SMD 510 OHM 5% 1/10W 0603; Manufacturer 1: Yageo; Manufacturer Part Number 1: RC0603JR-07510RL; Temperature Coefficient: ±100ppm/°C; Supplier 1: Digi-Key; Supplier Part Number 1: 311-510GRCT-ND; Packaging: Cut Tape (CT); Part Status: Active; Composition: Thick Film; Operating Temperature: -55°C ~ 155°C; Package / Case: 0603 (1608 Metric); Supplier Device Package: 0603; Size / Dimension: 0.063" L x 0.031" W (1.60mm x 0.80mm); Height - Seated (Max): 0.022" (0.55mm); Failure Rate: -; ComponentLink1URL: http://www.yageo.com/documents/recent/PYu-RC_Group_51_RoHS_L_7.pdf; ComponentLink1Description: http://www.yageo.com/documents/recent/PYu-RC_Group_51_RoHS_L_7.pdf; Tolerance: ±5%
R4 = RES 100K OHM 5% 1/8W 0603: RES SMD 100K OHM 5% 1/10W 0603; Manufacturer 1: Yageo; Manufacturer Part Number 1: RC0603JR-07100KL; Temperature Coefficient: ±100ppm/°C; Supplier 1: Digi-Key; Supplier Part Number 1: 311-100KGRCT-ND; Packaging: Cut Tape (CT); Part Status: Active; Composition: Thick Film; Operating Temperature: -55°C ~ 155°C; Package / Case: 0603 (1608 Metric); Supplier Device Package: 0603; Size / Dimension: 0.063" L x 0.031" W (1.60mm x 0.80mm); Height - Seated (Max): 0.022" (0.55mm); Failure Rate: -; ComponentLink1URL: http://www.yageo.com/documents/recent/PYu-RC_Group_51_RoHS_L_7.pdf; ComponentLink1Description: http://www.yageo.com/documents/recent/PYu-RC_Group_51_RoHS_L_7.pdf; Tolerance: ±5%
U3 = IC MCU 32BIT 128KB FLASH 48LQFP: ARM® Cortex®-M0 STM32 F0 Microcontroller IC 32-Bit 48MHz 128KB (128K x 8) FLASH 48-LQFP (7x7); Manufacturer 1: STMicroelectronics; Connectivity: CAN, HDMI-CEC, I²C, IrDA, LIN, SPI, UART/USART, USB; Peripherals: DMA, I²S, POR, PWM, WDT; Number of I/O: 37; RAM Size: 16K x 8; Voltage - Supply (Vcc/Vdd): 1.65 V ~ 3.6 V; Data Converters: A/D 10x12b, D/A 2x12b; Oscillator Type: Internal; Supplier 1: Digi-Key; Supplier Part Number 1: 497-14645-ND; Packaging: Tray; Part Status: Active; Core Processor: ARM® Cortex®-M0; Core Size: 32-Bit; Speed: 48MHz; Program Memory Size: 128KB (128K x 8); Program Memory Type: FLASH; EEPROM Size: -; Operating Temperature: -40°C ~ 85°C (TA); Package / Case: 48-LQFP; Supplier Device Package: 48-LQFP (7x7); ComponentLink1URL: http://www.st.com/content/ccc/resource/technical/document/datasheet/cd/46/43/83/22/d3/40/c8/DM00090510.pdf/files/DM00090510.pdf/jcr:content/translations/en.DM00090510.pdf; ComponentLink1Description: http://www.st.com/content/ccc/resource/technical/document/datasheet/cd/46/43/83/22/d3/40/c8/DM00090510.pdf/files/DM00090510.pdf/jcr:content/translations/en.DM00090510.pdf
Y1 = CRYSTAL 32 MHz 18PF 2-SMD: 32MHz ±20ppm Crystal 18pF 50 Ohms 2-SMD, No Lead /; Manufacturer: Abracon; Manufacturer Part Number: ABM7-32.000MHZ-D2Y-T; ESR (Equivalent Series Resistance): 50R; Frequency Stability: 30ppm; ComponentLink1URL: https://abracon.com/Resonators/abm3.pdf; ComponentLink1Description: https://abracon.com/Resonators/abm3.pdf; Supplier 1: Digi-Key; Supplier Part Number 1: 535-9850-1-ND; RoHS: Yes; Stock 1: 3351; Pricing 1: 1 = 1.00000, 10 = 0.88600, 50 = 0.82780, 100 = 0.73150, 500 = 0.69300 (USD); Mount: Surface Mount; Case/Package: CSMD; Number of Pins: 2; Min Operating Temperature: -40°C; Max Operating Temperature: 85°C; Package Quantity: 1000; Tolerance: 20ppm; Packaging: Tape and Reel; Frequency Tolerance: 20ppm; Termination: SMD/SMT; Composition: Ceramic; Series Resistance: 50R; Length: 6mm; Height: 0.055inch; Width: 3.3mm; Depth: 3.5mm; Radiation Hardening: No; REACH SVHC: Unknown; Lead Free: Lead Free; ComponentLink2URL: http://www.farnell.com/datasheets/947971.pdf?src-supplier=Element14; ComponentLink2Description: http://www.farnell.com/datasheets/947971.pdf?src-supplier=Element14; ComponentLink3URL: http://www.abracon.com/Resonators/abm7.pdf?src-supplier=Future+Electronics; ComponentLink3Description: http://www.abracon.com/Resonators/abm7.pdf?src-supplier=Future+Electronics; ComponentLink4URL: http://www.abracon.com/Resonators/abm7.pdf?src-supplier=Digi-Key; ComponentLink4Description: http://www.abracon.com/Resonators/abm7.pdf?src-supplier=Digi-Key; ComponentLink5URL: https://abracon.com/Resonators/abm7.pdf?src-supplier=Digi-Key; ComponentLink5Description: https://abracon.com/Resonators/abm7.pdf?src-supplier=Digi-Key; ComponentLink6URL: http://www.abracon.com/Resonators/abm7.pdf?src-supplier=Avnet; ComponentLink6Description: http://www.abracon.com/Resonators/abm7.pdf?src-supplier=Avnet

## Sheet Controller_Board.SchDoc: Controller Board - Power & CAN
size B; PageSetup: Record=PageOptions|CenterHorizontal=True|CenterVertical=True|PrintScale=0.64|XCorrection=1.00|YCorrection=1.00|PrintKind=1|BorderSize=5000000|LeftOffset=0|BottomOffset=0|Orientation=2|PaperLength=1000|PaperWidth=1000|Scale=100|PaperSource=7|PrintQuality=-3|MediaType=1|DitherType=10|PrintScaleMode=1|PaperKind=Letter|PaperIndex=1; Organization: Midnight Sun Solar Rayce Car Team; Address1: University of Waterloo; Address2: 200 University Ave W; Address3: Waterloo, ON, Canada; Address4: N2L 3E9; DocumentNumber: 3; SheetNumber: 3; SheetTotal: 3; Website: www.uwmidsun.com; ProjectName: ProjectName
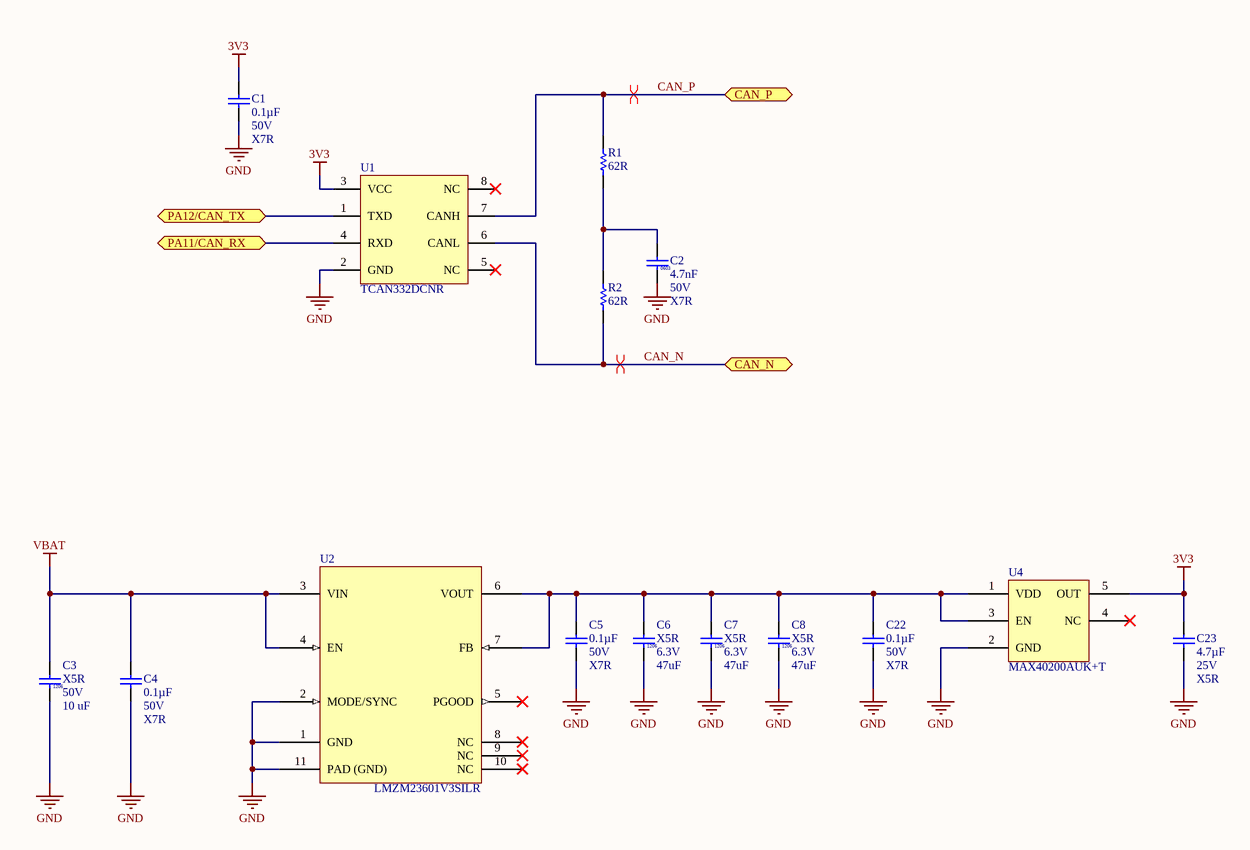
[diagram p2: Controller_Board.SchDoc]

### Parts
C1  Capacitance: 0.1µF  Voltage: 50V  Temperature Coefficient: X7R  [CAP, 0603]  (hidden comment: CAP CER 0.1UF 50V 10% X7R 0603)
C2  Capacitance: 4.7nF  Voltage: 50V  Dielectric: X7R  [CAP, 0603]  (hidden comment: CAP CER 4.7nF 50V 10% X7R 0603)
C3  Rating: X5R  Voltage Rating: 50V  Capacitance: 10 uF  [CAP, 1206]  (hidden comment: CAP CER 10uF 50V 20% X5R 1206)
C4  Capacitance: 0.1µF  Voltage: 50V  Temperature Coefficient: X7R  [CAP, 0603]  (hidden comment: CAP CER 0.1UF 50V 10% X7R 0603)
C5  Capacitance: 0.1µF  Voltage: 50V  Temperature Coefficient: X7R  [CAP, 0603]  (hidden comment: CAP CER 0.1UF 50V 10% X7R 0603)
C6  Dielectric: X5R  Voltage: 6.3V  Capacitance: 47uF  [CAP, 1206]  (hidden comment: CAP CER 47uF 6.3V X5R 1206)
C7  Dielectric: X5R  Voltage: 6.3V  Capacitance: 47uF  [CAP, 1206]  (hidden comment: CAP CER 47uF 6.3V X5R 1206)
C8  Dielectric: X5R  Voltage: 6.3V  Capacitance: 47uF  [CAP, 1206]  (hidden comment: CAP CER 47uF 6.3V X5R 1206)
C22  Capacitance: 0.1µF  Voltage: 50V  Temperature Coefficient: X7R  [CAP, 0603]  (hidden comment: CAP CER 0.1UF 50V 10% X7R 0603)
C23  Capacitance: 4.7µF  Voltage: 25V  Temperature Coefficient: X5R  [CAP, 0603]  (hidden comment: CAP CER 4.7UF 25V 10% X5R 0603)
R1  62R  [RES, 0603]
R2  62R  [RES, 0603]
U1  Manufacturer Part Number: TCAN332DCNR  [TSOP65P280X145-8N]  (hidden comment: IC CAN Tranceiver TCAN332DR)
U2  Manufacturer Part Number: LMZM23601V3SILR  [IC DCDC 3.3V 1A 10-uSIP]  (hidden comment: IC DC DC 3.3V 1A 10-uSIP)
U4  Manufacturer Part Number: MAX40200AUK+T  [SOT95P280X145-5N]  (hidden comment: IC IDEAL DIODE CURRENT SWITCH SOT23-5)

### Ports
CAN_N (bidir), CAN_P (bidir), PA11/CAN_RX (bidir), PA12/CAN_TX (bidir)

### Nets
3V3: C1.1 C23.1 U1.3(VCC) U4.5(OUT)
GND: C1.2 C2.2 C3.2 C4.2 C5.2 C6.2 C7.2 C8.2 C22.2 C23.2 U1.2(GND) U2.1(GND) U2.2(MODE/SYNC) U2.11(PAD_(GND)) U4.2(GND)
VBAT: C3.1 C4.1 U2.3(VIN) U2.4(EN)
CAN_N: R2.2 U1.6(CANL) ; port CAN_N
CAN_P: R1.1 U1.7(CANH) ; port CAN_P
PA11/CAN_RX: U1.4(RXD) ; port PA11/CAN_RX
PA12/CAN_TX: U1.1(TXD) ; port PA12/CAN_TX
NetC2_1: C2.1 R1.2 R2.1
NetC5_1: C5.1 C6.1 C7.1 C8.1 C22.1 U2.6(VOUT) U2.7(FB) U4.1(VDD) U4.3(EN)

Not connected (* = marked no-connect by the designer): U1 5(NC)* 8(NC)*; U2 5(PGOOD)* 8(NC)* 9(NC)* 10(NC)*; U4 4(NC)*

### Layout directives
differential pair: CAN_N, CAN_P

### Notes on the sheet
- PROJECT
- DOCUMENT
- DRAWN BY
- LAST MODIFIED
- PART NUMBER
- REVISION
- SHEET
- VARIANT
- OF
- Engineering 5 - 1002
  University of Waterloo
  (519) 888-4567 x32978
  hardware@uwmidsun.com

### Library data of the parts
C1 C4 C5 C22 = CAP CER 0.1UF 50V 10% X7R 0603: as C21 on sheet Controller Board - Connectors; Supplier 1: Digi-Key; Supplier Part Number 1: 478-5052-1-ND; Packaging: Cut Tape (CT); Part Status: Active; Operating Temperature: -55°C ~ 125°C; Ratings: -; Mounting Type: Surface Mount, MLCC; Package / Case: 0603 (1608 Metric); Size / Dimension: 0.063" L x 0.032" W (1.60mm x 0.81mm); Height - Seated (Max): -; Thickness (Max): 0.035" (0.90mm); Lead Spacing: -; Lead Style: -; ComponentLink1URL: http://datasheets.avx.com/X7RDielectric.pdf; ComponentLink1Description: http://datasheets.avx.com/X7RDielectric.pdf; Tolerance: ±10%
C2 = CAP CER 4.7nF 50V 10% X7R 0603: 4700pF ±10% 50V Ceramic Capacitor X7R 0603 (1608 Metric) /; Manufacturer: Murata; Manufacturer Part Number: GCM188R71H472KA37D; Supplier 1: Digi-Key; Supplier Part Number 1: 490-4932-1-ND; Packaging: Tape and Reel; Ratings: AEC-Q200; ComponentLink1URL: http://search.murata.co.jp/Ceramy/image/img/A01X/partnumbering_e_02.pdf?src-supplier=Digi-Key; ComponentLink1Description: http://search.murata.co.jp/Ceramy/image/img/A01X/partnumbering_e_02.pdf?src-supplier=Digi-Key; Tolerance: 10%; RoHS: Yes; Stock 1: 824762; Pricing 1: 1 = 0.21000, 10 = 0.15100, 100 = 0.07080, 500 = 0.04964, 1000 = 0.04109 (USD); Mount: Surface Mount; Case/Package: 0603; Weight: 7.1E-05oz; Case Code (Metric): 1608; Case Code (Imperial): 0603; Min Operating Temperature: -55°C; Max Operating Temperature: 125°C; Package Quantity: 1; Voltage Rating: 50V; Voltage Rating (DC): 50V; Termination: SMD/SMT; Length: 1.6mm; Height: 0.8mm; Width: 0.031inch; Thickness: 0.035inch; Depth: 0.8mm; Radiation Hardening: No; REACH SVHC: No SVHC; Lead Free: Lead Free; ComponentLink2URL: http://uk.rs-online.com/webdocs/0ef9/0900766b80ef92d0.pdf?src-supplier=RSComponents; ComponentLink2Description: http://uk.rs-online.com/webdocs/0ef9/0900766b80ef92d0.pdf?src-supplier=RSComponents; ComponentLink3URL: https://www.verical.com/server-webapp/html/getDatasheet?partID=223879&src-supplier=Verical; ComponentLink3Description: https://www.verical.com/server-webapp/html/getDatasheet?partID=223879&src-supplier=Verical; ComponentLink4URL: http://psearch.murata.com/capacitor/product/GCM188R71H472KA37%23.pdf?src-supplier=Avnet; ComponentLink4Description: http://psearch.murata.com/capacitor/product/GCM188R71H472KA37%23.pdf?src-supplier=Avnet
C3 = CAP CER 10uF 50V 20% X5R 1206: as C20 on sheet Controller Board - Connectors; Supplier 1: Digi-Key; Supplier Part Number 1: 490-12457-1-ND; RoHS: Yes; Stock 1: 449467; Pricing 1: 1 = 0.57000, 10 = 0.39800, 100 = 0.23910, 500 = 0.17930, 1000 = 0.15141 (USD); Mount: Surface Mount; Case/Package: 1206; Case Code (Metric): 3216; Case Code (Imperial): 1206; Min Operating Temperature: -55°C; Max Operating Temperature: 85°C; Packaging: Tape and Reel; Tolerance: 20%; Length: 0.126inch; Width: 0.063inch; Thickness: 0.071inch; Ratings: AEC-Q200
C6-C8 = CAP CER 47uF 6.3V X5R 1206: 47µF ±20% 6.3V Ceramic Capacitor X5R 1206 (3216 Metric) /; Manufacturer: Samsung; Manufacturer Part Number: CL31A476MQHNNNE; Supplier 1: Digi-Key; Supplier Part Number 1: 1276-1167-1-ND; RoHS: Yes; Stock 1: 888566; Pricing 1: 1 = 0.44000, 10 = 0.30600, 100 = 0.18340, 500 = 0.13754, 1000 = 0.11614 (USD); Mount: Surface Mount; Case/Package: 1206; Case Code (Metric): 3216; Case Code (Imperial): 1206; Material: Ceramic; Contact Plating: Tin; Min Operating Temperature: -55°C; Max Operating Temperature: 85°C; Tolerance: 20%; Packaging: Tape and Reel; Package Quantity: 1; Voltage Rating: 6.3V; Length: 3.2mm; Height: 1.6mm; Width: 0.063inch; Thickness: 0.071inch; Depth: 1.6mm; Radiation Hardening: No; ComponentLink1URL: http://www.samsungsem.com/kr/support/product-search/mlcc/CL31A476MQHNNNE.jsp?src-supplier=Digi-Key; ComponentLink1Description: http://www.samsungsem.com/kr/support/product-search/mlcc/CL31A476MQHNNNE.jsp?src-supplier=Digi-Key; ComponentLink2URL: https://www.verical.com/server-webapp/html/getDatasheet?partID=358369&src-supplier=Verical; ComponentLink2Description: https://www.verical.com/server-webapp/html/getDatasheet?partID=358369&src-supplier=Verical; ComponentLink3URL: http://www1.futureelectronics.com/doc/SAMSUNG/CL31A476MQHNNNE.pdf?src-supplier=Future+Electronics; ComponentLink3Description: http://www1.futureelectronics.com/doc/SAMSUNG/CL31A476MQHNNNE.pdf?src-supplier=Future+Electronics; ComponentLink4URL: https://produktinfo.conrad.com/datenblaetter/450000-474999/452054-da-01-en-VS_KONDENSATOR_1206.pdf?src-supplier=Conrad; ComponentLink4Description: https://produktinfo.conrad.com/datenblaetter/450000-474999/452054-da-01-en-VS_KONDENSATOR_1206.pdf?src-supplier=Conrad
C23 = CAP CER 4.7UF 25V 10% X5R 0603: as C11 on sheet Controller Board - Microcontroller; Supplier 1: Digi-Key; Supplier Part Number 1: 490-7203-1-ND; Packaging: Cut Tape (CT); Part Status: Active; Operating Temperature: -55°C ~ 85°C; Ratings: -; Mounting Type: Surface Mount, MLCC; Package / Case: 0603 (1608 Metric); Size / Dimension: 0.063" L x 0.031" W (1.60mm x 0.80mm); Height - Seated (Max): -; Thickness (Max): 0.031" (0.80mm); Lead Spacing: -; Lead Style: -; ComponentLink1URL: http://www.murata.com/~/media/webrenewal/support/library/catalog/products/capacitor/mlcc/c02e.ashx; ComponentLink1Description: http://www.murata.com/~/media/webrenewal/support/library/catalog/products/capacitor/mlcc/c02e.ashx; Tolerance: ±10%
R1 R2 = RES 62 OHM 0.1% 1/10W 0603: 62 Ohms ±0.1% 0.1W, 1/10W Chip Resistor 0603 (1608 Metric) Automotive AEC-Q200 Thin Film; Manufacturer: Panasonic Electronic Components; Manufacturer Part Number: ERA-3AEB620V; Temperature Coefficient: ±25ppm/°C; Value: 62; Supplier 1: Digi-Key; RoHS: RoHS Compliant; Category: Resistors; Stock 1: 10320; Pricing 1: 1=0.52, 10=0.447, 100=0.1748, 1000=0.07317, 2500=0.06708 (CAD); Packaging: Cut Tape (CT); Part Status: Active; Tolerance: ±0.1%; Power (Watts): 0.1W, 1/10W; Composition: Thin Film; Features: Automotive AEC-Q200; Operating Temperature: -55°C ~ 155°C; Package / Case: 0603 (1608 Metric); Supplier Device Package: 0603; Size / Dimension: 0.063" L x 0.032" W (1.60mm x 0.80mm); Height - Seated (Max): 0.022" (0.55mm); Failure Rate: -; ComponentLink1URL: https://industrial.panasonic.com/cdbs/www-data/pdf/RDM0000/AOA0000C307.pdf; ComponentLink1Description: https://industrial.panasonic.com/cdbs/www-data/pdf/RDM0000/AOA0000C307.pdf; Supplier Part Number 1: P62DBCT-ND
U1 = IC CAN Tranceiver TCAN332DR: 1/1 Transceiver CANbus SOT-23-8; Manufacturer: Texas Instruments; Supplier 1: Digi-Key; Supplier Part Number 1: 296-47355-1-ND; Stock 1: 2387; Pricing 1: 1 = 2.27000, 10 = 2.04200, 100 = 1.64100, 500 = 1.34828, 1000 = 1.11714 (USD); Min Operating Temperature: -40°C; Max Operating Temperature: 125°C; Lead Free: Lead Free
U2 = IC DC DC 3.3V 1A 10-uSIP: Non-Isolated PoL Module DC DC Converter 1 Output 3.3V 1A 4V - 36V Input; Manufacturer: Texas Instruments; Supplier 1: Digi-Key; Supplier Part Number 1: 296-51381-1-ND; Stock 1: 1291; Pricing 1: 1 = 5.76000, 10 = 5.17700, 100 = 4.24200, 500 = 3.61110, 1000 = 3.04550 (USD); Min Operating Temperature: -40°C; Max Operating Temperature: 125°C; ComponentLink1Description: Datasheet; ComponentLink1URL: http://www.ti.com/lit/ds/symlink/lmzm23601.pdf
U4 = IC IDEAL DIODE CURRENT SWITCH SOT23-5: OR Controller Source Selector Switch P-Channel 1:1 SOT-23-5; Manufacturer: Maxim; Supplier 1: Digi-Key; Supplier Part Number 1: MAX40200AUK+TCT-ND; Stock 1: 7780; Pricing 1: 1 = 0.93000, 10 = 0.82100, 100 = 0.62930, 500 = 0.49750, 1000 = 0.39799 (USD); ComponentLink1Description: Datasheet; ComponentLink1URL: https://datasheets.maximintegrated.com/en/ds/MAX40200.pdf

## Nets that join several sheets
3V3: Controller Board - Connectors (7 pins), Controller Board - Microcontroller (11 pins), Controller_Board (C1.1 C23.1 U1.3 U4.5)
GND: Controller Board - Connectors (15 pins), Controller Board - Microcontroller (19 pins), Controller_Board (15 pins)
VBAT: Controller Board - Connectors (6 pins), Controller_Board (C3.1 C4.1 U2.3 U2.4)
CAN_N: Controller Board - Connectors (D1.1 D2.1 P1.2 P2.2), Controller_Board (R2.2 U1.6)
CAN_P: Controller Board - Connectors (D1.2 D2.2 P1.1 P2.1), Controller_Board (R1.1 U1.7)
NRST: Controller Board - Connectors (J1.10), Controller Board - Microcontroller (C16.2 R4.1 U3.7)
PA0: Controller Board - Connectors (P3.25), Controller Board - Microcontroller (U3.10)
PA1: Controller Board - Connectors (P3.24), Controller Board - Microcontroller (U3.11)
PA2/USART2_TX: Controller Board - Connectors (P3.23), Controller Board - Microcontroller (U3.12)
PA3/USART2_RX: Controller Board - Connectors (P3.22), Controller Board - Microcontroller (U3.13)
PA4/SPI1_NSS/PWM_TIM14: Controller Board - Connectors (P3.21), Controller Board - Microcontroller (U3.14)
PA5/SPI1_SCK: Controller Board - Connectors (P3.20), Controller Board - Microcontroller (U3.15)
PA6/SPI1_MISO: Controller Board - Connectors (P3.19), Controller Board - Microcontroller (U3.16)
PA7/SPI1_MOSI: Controller Board - Connectors (P3.18), Controller Board - Microcontroller (U3.17)
PA8/PWM_TIM1: Controller Board - Connectors (P3.7), Controller Board - Microcontroller (U3.29)
PA9: Controller Board - Connectors (P3.6), Controller Board - Microcontroller (U3.30)
PA10: Controller Board - Connectors (P3.5), Controller Board - Microcontroller (U3.31)
PA11/CAN_RX: Controller Board - Microcontroller (U3.32), Controller_Board (U1.4)
PA12/CAN_TX: Controller Board - Microcontroller (U3.33), Controller_Board (U1.1)
PA13/SWDIO: Controller Board - Connectors (J1.2), Controller Board - Microcontroller (U3.34)
PA14/SWCLK: Controller Board - Connectors (J1.4), Controller Board - Microcontroller (U3.37)
PA15/LED_BLUE: Controller Board - Connectors (P3.39), Controller Board - Microcontroller (R3.1 U3.38)
PB0/PWM_TIM3: Controller Board - Connectors (P3.17), Controller Board - Microcontroller (U3.18)
PB1: Controller Board - Connectors (P3.16), Controller Board - Microcontroller (U3.19)
PB2: Controller Board - Connectors (P3.15), Controller Board - Microcontroller (U3.20)
PB3_LED_RED: Controller Board - Connectors (P3.38), Controller Board - Microcontroller (R6.1 U3.39)
PB4_LED_YELLOW: Controller Board - Connectors (P3.37), Controller Board - Microcontroller (R7.1 U3.40)
PB5_LED_GREEN: Controller Board - Connectors (P3.36), Controller Board - Microcontroller (R8.1 U3.41)
PB6/DEBUG_USART1_TX: Controller Board - Connectors (J1.6 P3.34), Controller Board - Microcontroller (U3.42)
PB7/DEBUG_USART1_RX: Controller Board - Connectors (J1.8 P3.33), Controller Board - Microcontroller (U3.43)
PB8/I2C1_SCL: Controller Board - Connectors (P3.32), Controller Board - Microcontroller (U3.45)
PB9/I2C1_SDA: Controller Board - Connectors (P3.31), Controller Board - Microcontroller (U3.46)
PB10/USART3_TX/I2C2_SCL: Controller Board - Connectors (P3.14), Controller Board - Microcontroller (U3.21)
PB11/USART3_RX/I2C2_SDA: Controller Board - Connectors (P3.13), Controller Board - Microcontroller (U3.22)
PB12/SPI2_NSS: Controller Board - Connectors (P3.11), Controller Board - Microcontroller (U3.25)
PB13/SPI2_SCK: Controller Board - Connectors (P3.10), Controller Board - Microcontroller (U3.26)
PB14/SPI2_MISO: Controller Board - Connectors (P3.9), Controller Board - Microcontroller (U3.27)
PB15/SPI2_MOSI: Controller Board - Connectors (P3.8), Controller Board - Microcontroller (U3.28)
PC13: Controller Board - Connectors (P3.30), Controller Board - Microcontroller (U3.2)